# EAGLE schematic Mother Board_ver2.0.0 (EAGLE 9.6.2)
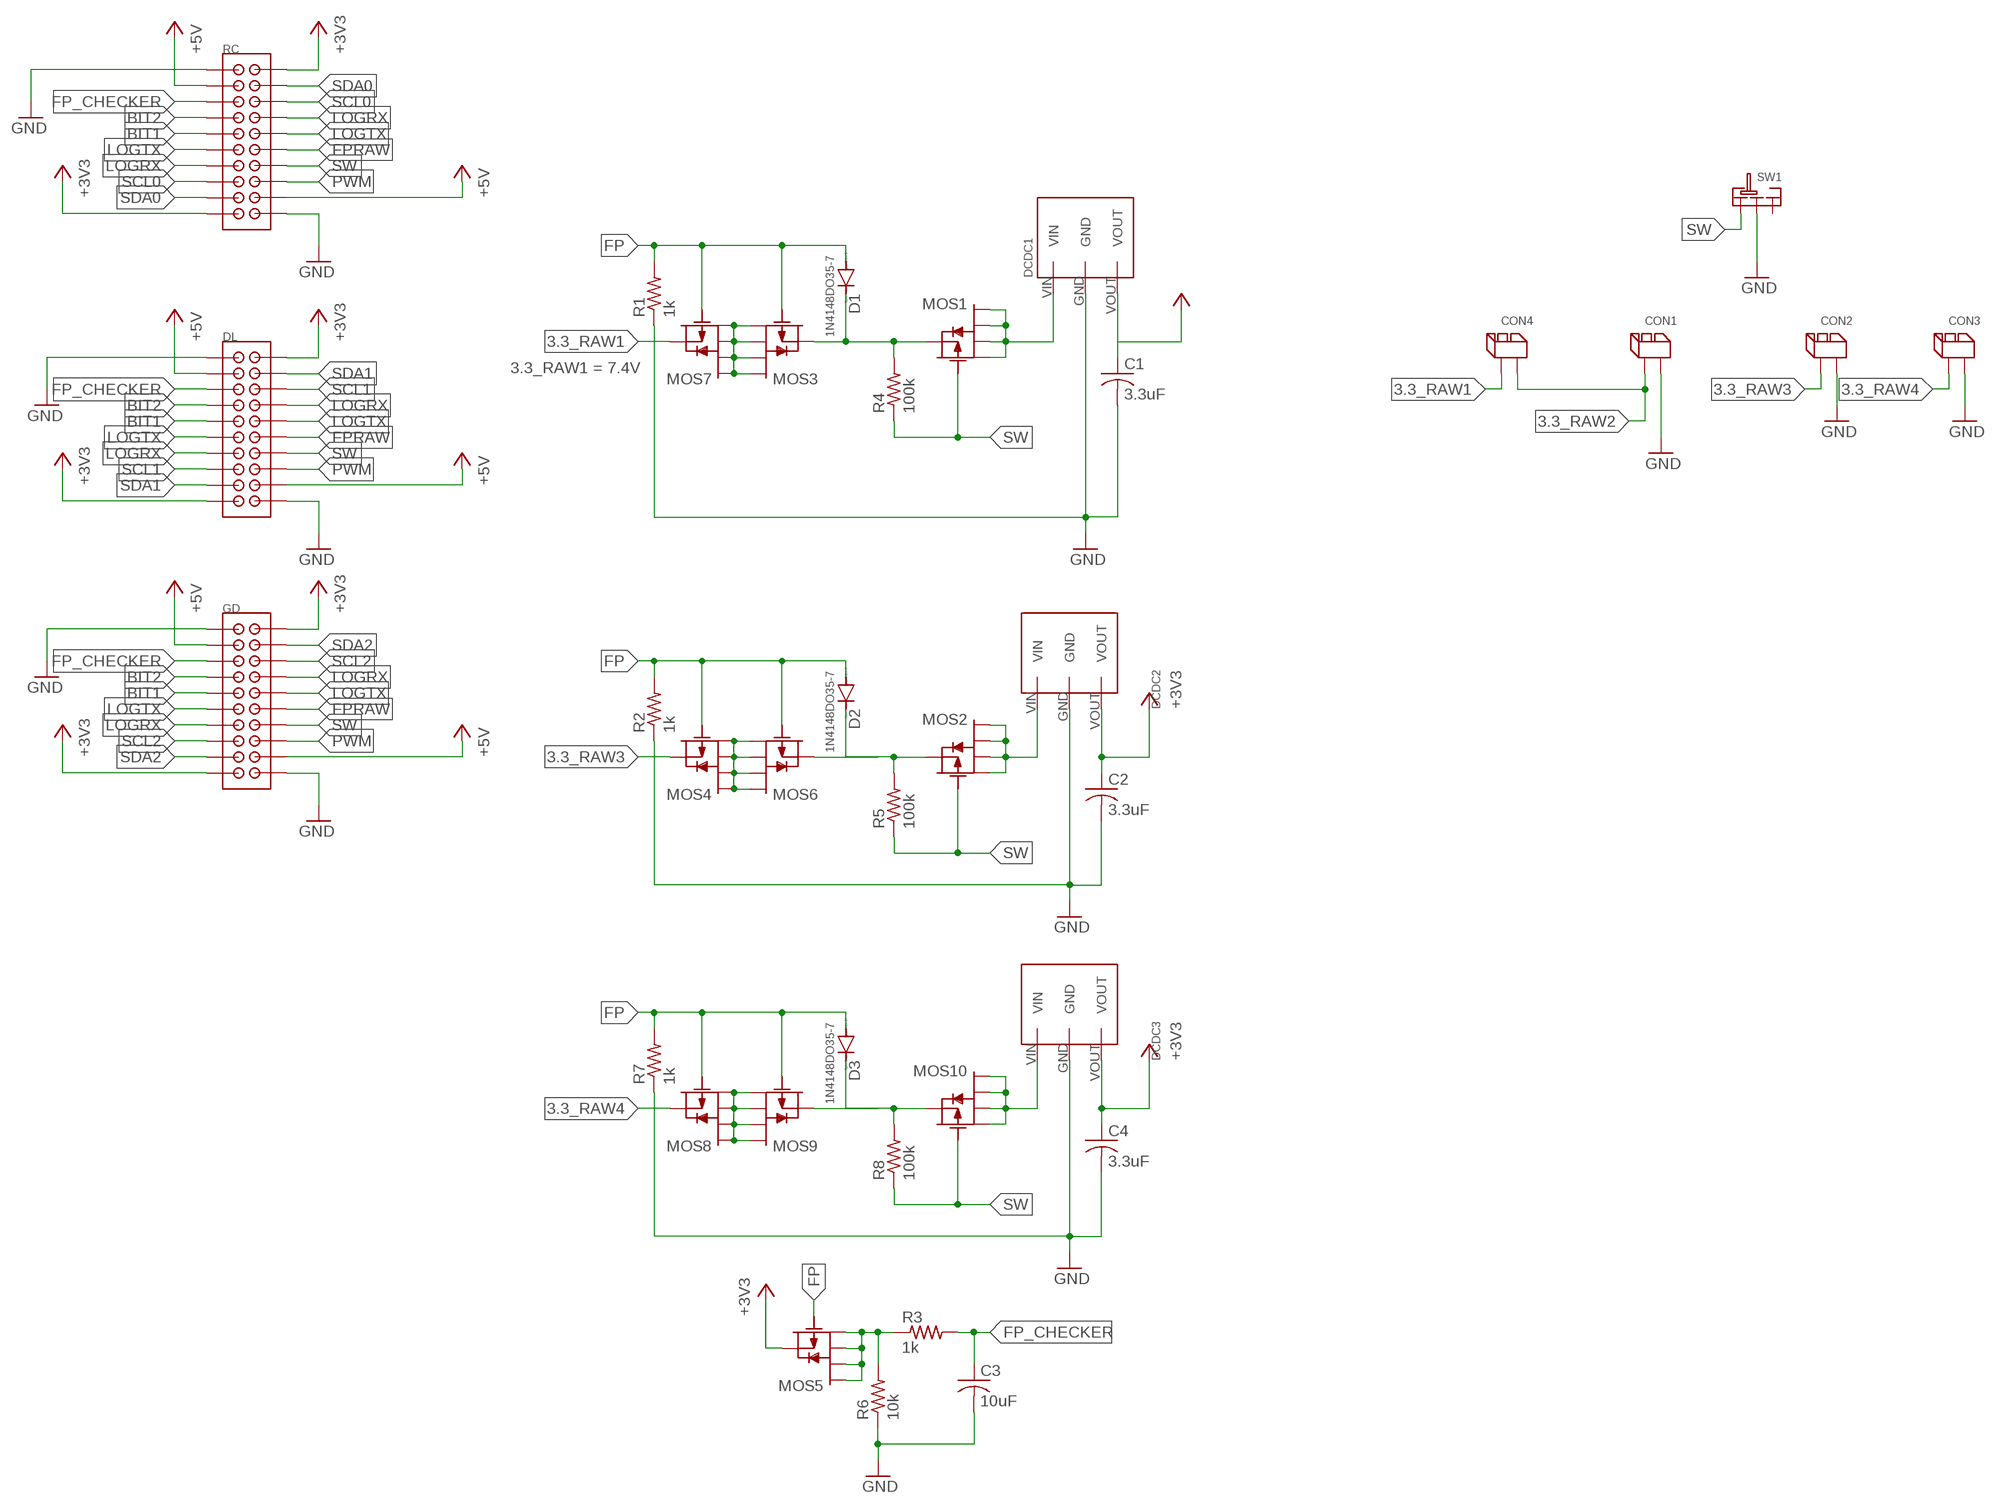
[diagram p0: schematic, sheet 1]

## Parts
C1  3.3uF  C-USC0603  [C0603]
C2  3.3uF  C-USC0603  [C0603]
C3  10uF  C-USC0603  [C0603]
C4  3.3uF  C-USC0603  [C0603]
CON1  2PIN  [2PIN]
CON2  2PIN  [2PIN]
CON3  2PIN  [2PIN]
CON4  2PIN  [2PIN]
D1  1N4148DO35-7  [DO35-7]
D2  1N4148DO35-7  [DO35-7]
D3  1N4148DO35-7  [DO35-7]
DCDC1  5V1A_M78AR05-1  [5V1A_M78AR05-1]
DCDC2  3.3V1A_M78AR033-1  [3.3V1A_M78AR033-1]
DCDC3  3.3V1A_M78AR033-1  [3.3V1A_M78AR033-1]
DL  2X10  [2X10]
GD  2X10  [2X10]
MOS1  PCH_SSM6J808R  [SSM6J808R]
MOS2  PCH_SSM6J808R  [SSM6J808R]
MOS3  PCH_SSM6J808R  [SSM6J808R]
MOS4  PCH_SSM6J808R  [SSM6J808R]
MOS5  PCH_SSM6J808R  [SSM6J808R]
MOS6  PCH_SSM6J808R  [SSM6J808R]
MOS7  PCH_SSM6J808R  [SSM6J808R]
MOS8  PCH_SSM6J808R  [SSM6J808R]
MOS9  PCH_SSM6J808R  [SSM6J808R]
MOS10  PCH_SSM6J808R  [SSM6J808R]
R1  1k  R-US_R0603  [R0603]
R2  1k  R-US_R0603  [R0603]
R3  1k  R-US_R0603  [R0603]
R4  100k  R-US_R0603  [R0603]
R5  100k  R-US_R0603  [R0603]
R6  10k  R-US_R0603  [R0603]
R7  1k  R-US_R0603  [R0603]
R8  100k  R-US_R0603  [R0603]
RC  2X10  [2X10]
SW1  SRIDE_SWITCH  [SRIDE_SWITCH]

## Nets
3.3_RAW1: CON4.P$2 MOS7.4
3.3_RAW2: CON1.P$2 CON4.P$1
3.3_RAW3: CON2.P$2 MOS4.4
3.3_RAW4: CON3.P$2 MOS8.4
+3V3: C2.1 C4.1 DCDC2.VOUT DCDC3.VOUT DL.P$2 DL.P$19 GD.P$2 GD.P$19 MOS5.4 RC.P$2 RC.P$19
+5V: C1.1 DCDC1.VOUT DL.P$3 DL.P$18 GD.P$3 GD.P$18 RC.P$3 RC.P$18
+5V1: DCDC1.VIN MOS1.1 MOS1.2 MOS1.5 MOS1.6
BIT1: DL.P$9 GD.P$9 RC.P$9
BIT2: DL.P$7 GD.P$7 RC.P$7
FP: D1.A D2.A D3.A MOS3.3 MOS4.3 MOS5.3 MOS6.3 MOS7.3 MOS8.3 MOS9.3 R1.2 R2.2 R7.2
FP_CHECKER: C3.1 DL.P$5 GD.P$5 R3.2 RC.P$5
FPRAW: DL.P$12 GD.P$12 RC.P$12
GND: C1.2 C2.2 C3.2 C4.2 CON1.P$1 CON2.P$1 CON3.P$1 DCDC1.GND DCDC2.GND DCDC3.GND DL.P$1 DL.P$20 GD.P$1 GD.P$20 R1.1 R2.1 R6.1 R7.1 RC.P$1 RC.P$20 SW1.LR
LOGRX: DL.P$8 DL.P$13 GD.P$8 GD.P$13 RC.P$8 RC.P$13
LOGTX: DL.P$10 DL.P$11 GD.P$10 GD.P$11 RC.P$10 RC.P$11
N$1: D2.C MOS2.4 MOS6.4 R5.2
N$2: MOS4.1 MOS4.2 MOS4.5 MOS4.6 MOS6.1 MOS6.2 MOS6.5 MOS6.6
N$3: D3.C MOS9.4 MOS10.4 R8.2
N$4: MOS8.1 MOS8.2 MOS8.5 MOS8.6 MOS9.1 MOS9.2 MOS9.5 MOS9.6
N$5: DCDC2.VIN MOS2.1 MOS2.2 MOS2.5 MOS2.6
N$6: DCDC3.VIN MOS10.1 MOS10.2 MOS10.5 MOS10.6
N$11: D1.C MOS1.4 MOS3.4 R4.2
N$12: MOS3.1 MOS3.2 MOS3.5 MOS3.6 MOS7.1 MOS7.2 MOS7.5 MOS7.6
N$14: MOS5.1 MOS5.2 MOS5.5 MOS5.6 R3.1 R6.2
PWM: DL.P$16 GD.P$16 RC.P$16
SCL0: RC.P$6 RC.P$15
SCL1: DL.P$6 DL.P$15
SCL2: GD.P$6 GD.P$15
SDA0: RC.P$4 RC.P$17
SDA1: DL.P$4 DL.P$17
SDA2: GD.P$4 GD.P$17
SW: DL.P$14 GD.P$14 MOS1.3 MOS2.3 MOS10.3 R4.1 R5.1 R8.1 RC.P$14 SW1.L
Unconnected: SW1.R

## Notes on the sheet
- 3.3_RAW1 = 7.4V

## Library data of the parts
C1-C4 = rcl:C-US: CAPACITOR, American symbol; SPICEPREFIX: C
CON1-CON4 = XR Connector:2PIN
D1-D3 = diode:1N4148: DIODE high speed (Philips)
DCDC1 = DC-DC:5V1A_M78AR05-1
DCDC2 DCDC3 = DC-DC:3.3V1A_M78AR033-1
DL GD RC = PinSocket:2X10
MOS1-MOS10 = Chip MOSFET:PCH_SSM6J808R
R1-R8 = rcl:R-US_: RESISTOR, American symbol; SPICEPREFIX: R
SW1 = Sride Switch:SRIDE_SWITCH

## Net classes
0 default: width 0.406 mm
1 esp: width 0.406 mm, drill 0.127 mm, clearance 0.025 mm